# EAGLE design robot_booster (EAGLE 7.5.0)
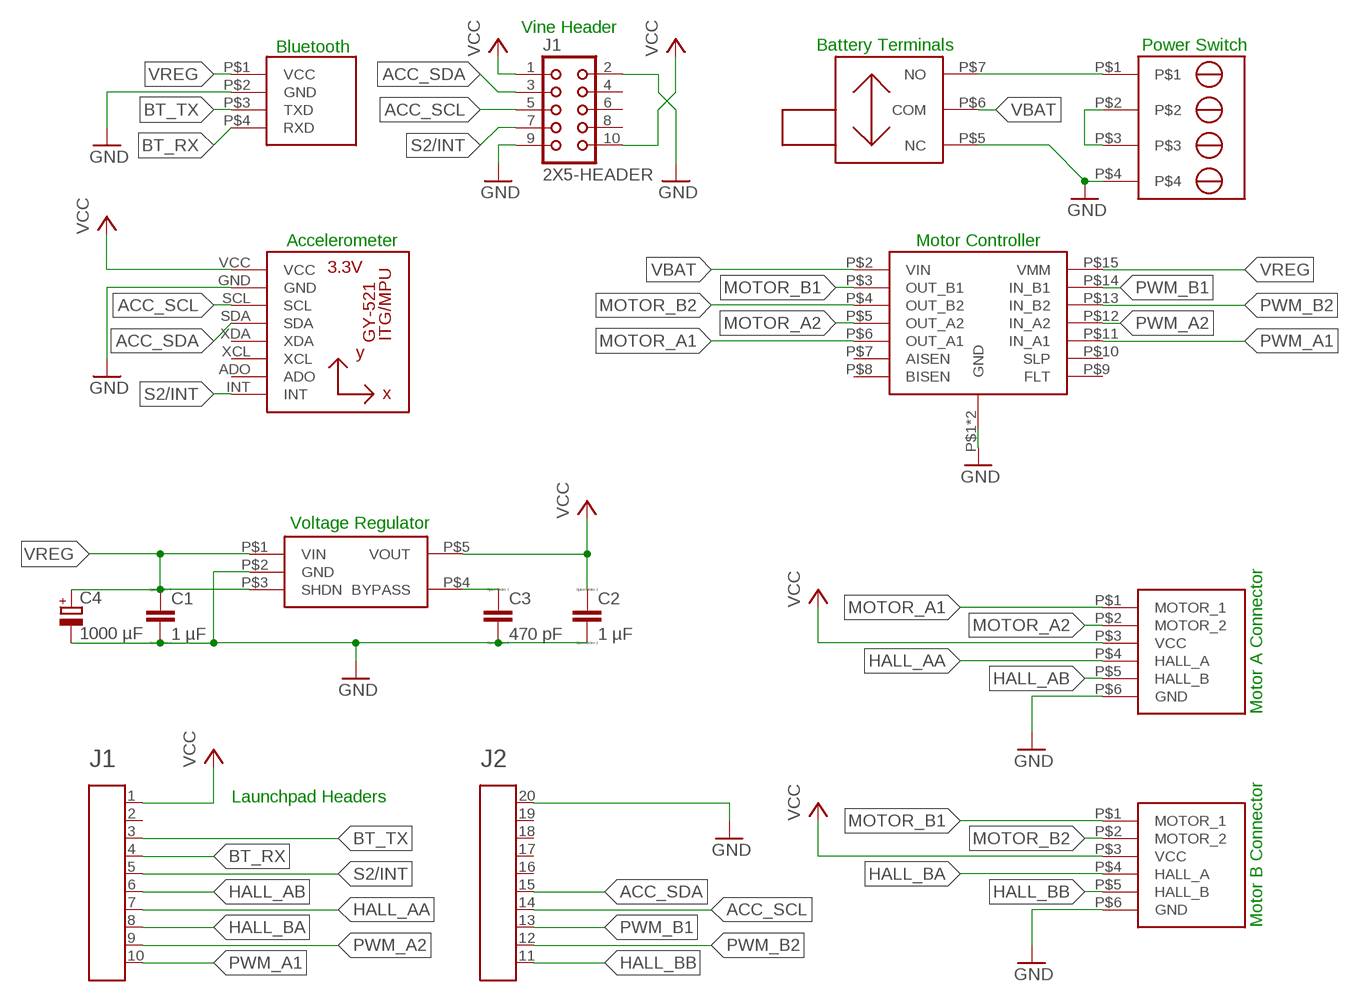
[diagram p0: schematic, sheet 1]

## Parts
C1  1 µF  CC0603  [C0603]
C2  1 µF  CC0603  [C0603]
C3  470 pF  CC0603  [C0603]
C4  1000 µF  CPOL-EUE5-5  [E5-5]
J1  2X5-HEADER  [2X5_1.27MM_SMALL]
U1  GY-521-HEADER  [GY-521-HEADER]
U$1  HEADER2X10-BOOSTERPACK  [2X10-BOOSTERPACK]
U$2  POLOLU-MICROMETAL-ENCODER  [2MM-1X6-JST]
U$3  POLOLU-MICROMETAL-ENCODER  [2MM-1X6-JST]
U$4  POLOLU-DRV8833  [HEADER-2X8-4W]
U$5  TC1015  [5-PIN-SOT-23]
U$6  HC06-RIGHT-ANGLE-HEADER  [HEADER-4X1-RIGHT-ANGLE]
U$7  1X4-SCREW-TERMINAL-BLOCK-OSTTE040104  [1X04-SCREW-TERMINAL-BLOCK-OSTTE040104]
U$8  SWITCH-EG1224  [SWITCH-EG122-RIGHT-ANGLE]

## Nets
ACC_SCL: J1.5 U1.SCL U$1.14
ACC_SDA: J1.3 U1.SDA U$1.15
BT_RX: U$1.4 U$6.P$4(RXD)
BT_TX: U$1.3 U$6.P$3(TXD)
GND [HiPWR]: C1.2 C2.2 C3.2 C4.- J1.2 J1.9 U1.GND U$1.20 U$2.P$6(GND) U$3.P$6(GND) U$4.P$1(GND) U$4.P$16(GND) U$5.P$2(GND) U$6.P$2(GND) U$7.P$4 U$8.P$5(NC)
HALL_AA: U$1.7 U$2.P$4(HALL_A)
HALL_AB: U$1.6 U$2.P$5(HALL_B)
HALL_BA: U$1.8 U$3.P$4(HALL_A)
HALL_BB: U$1.11 U$3.P$5(HALL_B)
MOTOR_A1 [PWR]: U$2.P$1(MOTOR_1) U$4.P$6(OUT_A1)
MOTOR_A2 [PWR]: U$2.P$2(MOTOR_2) U$4.P$5(OUT_A2)
MOTOR_B1 [PWR]: U$3.P$1(MOTOR_1) U$4.P$3(OUT_B1)
MOTOR_B2 [PWR]: U$3.P$2(MOTOR_2) U$4.P$4(OUT_B2)
N$1 [HiPWR]: U$7.P$2 U$7.P$3
N$2 [HiPWR]: U$7.P$1 U$8.P$7(NO)
N$5: C3.1 U$5.P$4(BYPASS)
PWM_A1: U$1.10 U$4.P$11(IN_A1)
PWM_A2: U$1.9 U$4.P$12(IN_A2)
PWM_B1: U$1.13 U$4.P$14(IN_B1)
PWM_B2: U$1.12 U$4.P$13(IN_B2)
S2/INT: J1.7 U1.INT U$1.5
VBAT [HiPWR]: U$4.P$2(VIN) U$8.P$6(COM)
VCC [PWR]: C2.1 J1.1 J1.10 U1.VCC U$1.1 U$2.P$3(VCC) U$3.P$3(VCC) U$5.P$5(VOUT)
VREG [PWR]: C1.1 C4.+ U$4.P$15(VMM) U$5.P$1(VIN) U$5.P$3(SHDN) U$6.P$1(VCC)
Unconnected: J1.4 J1.6 J1.8 U1.ADO U1.XCL U1.XDA U$1.2 U$1.16 U$1.17 U$1.18 U$1.19 U$4.P$7(AISEN) U$4.P$8(BISEN) U$4.P$9(FLT) U$4.P$10(SLP)

## Notes on the sheet
- Vine Header
- Bluetooth | Battery Terminals | Power Switch
- Accelerometer | Motor Controller
- Voltage Regulator
- Motor A Connector
- Launchpad Headers
- Motor B Connector

## Library data of the parts
C1-C3 = eagle-ltspice:C: CAPACITOR, European symbol; SPICEMODEL: NONE; SPICEPREFIX: C
C4 = rcl:CPOL-EU: POLARIZED CAPACITOR, European symbol
J1 = 00_headers:2X5-HEADER
U1 = gy-521:GY-521-HEADER
U$1 = EAGLE_BoosterPack_Library:HEADER2X10-BOOSTERPACK
U$2 U$3 = 00_peripherals:POLOLU-MICROMETAL-ENCODER
U$4 = 00_peripherals:POLOLU-DRV8833
U$5 = 00_peripherals:TC1015
U$6 = 00_peripherals:HC06-RIGHT-ANGLE-HEADER
U$7 = 00_headers:1X4-SCREW-TERMINAL-BLOCK-OSTTE040104
U$8 = 00_peripherals:SWITCH-EG1224

## Net classes
0 default: drill 0.254 mm
1 PWR: width 0.406 mm, drill 0.305 mm
2 HiPWR: width 0.406 mm, drill 0.406 mm

## Board
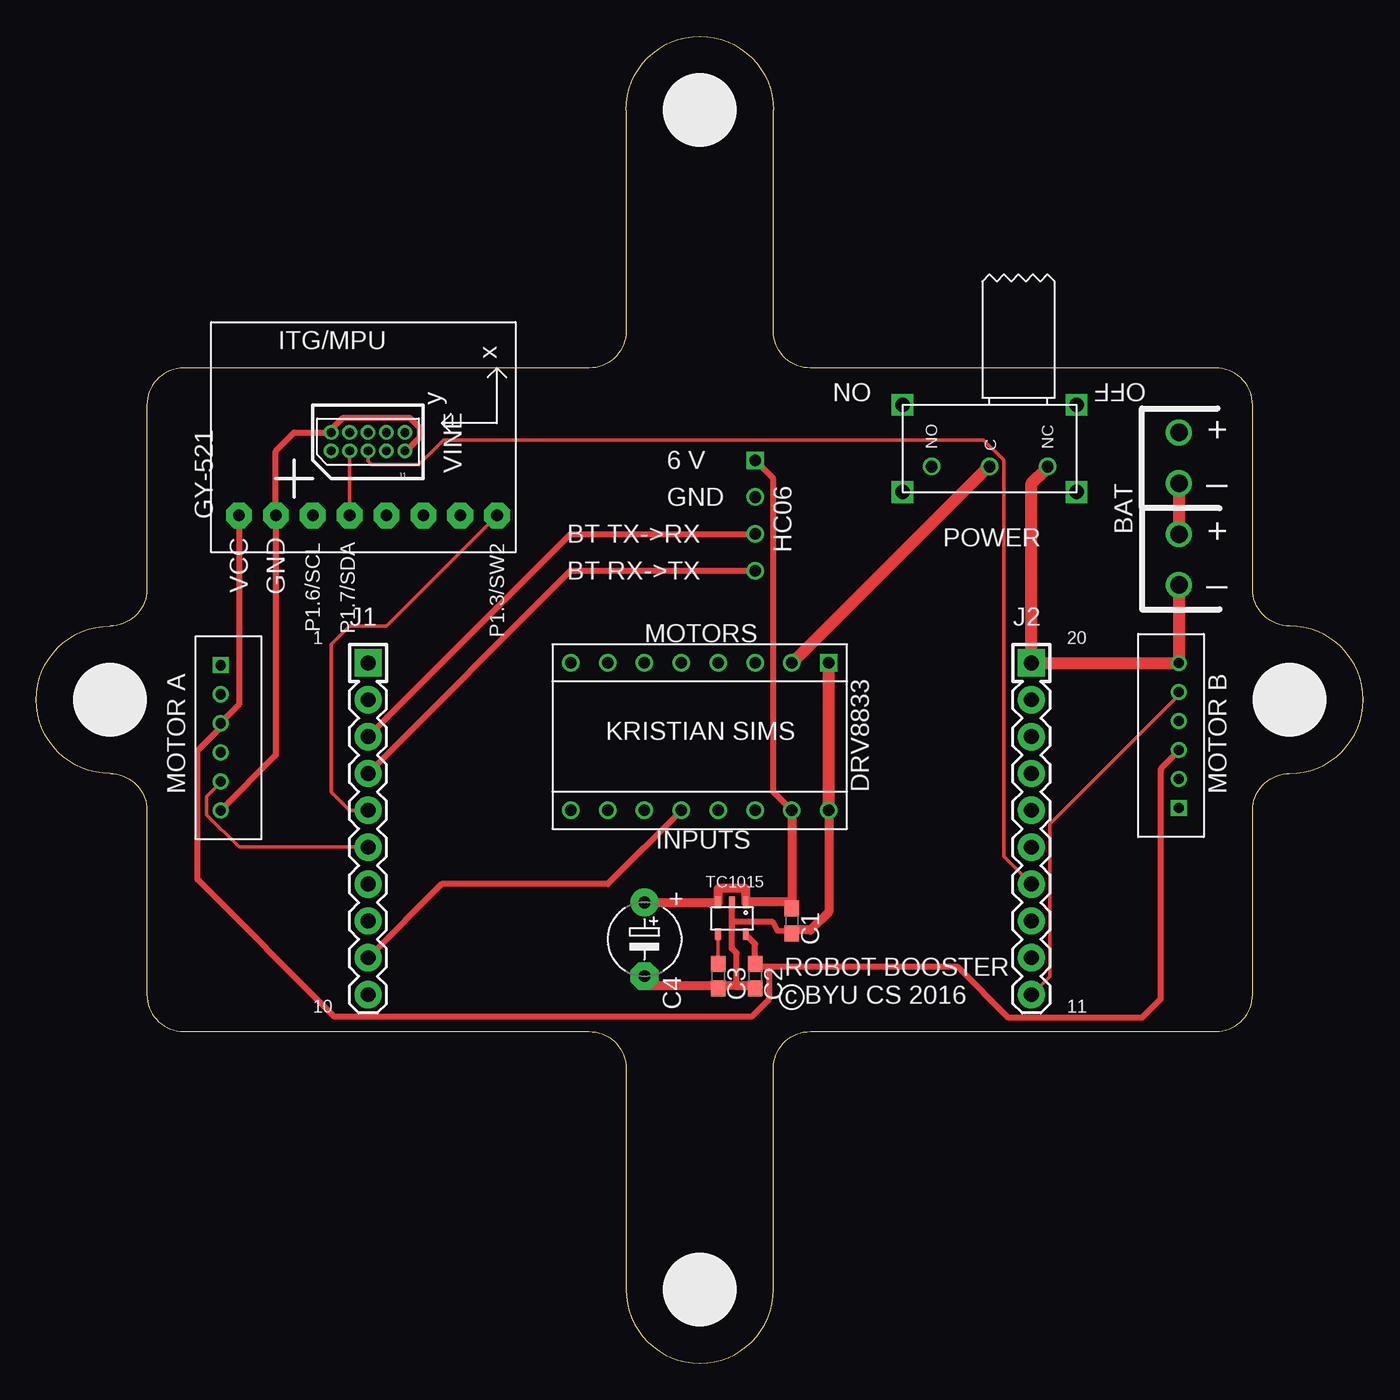
[diagram p1: board, top side]
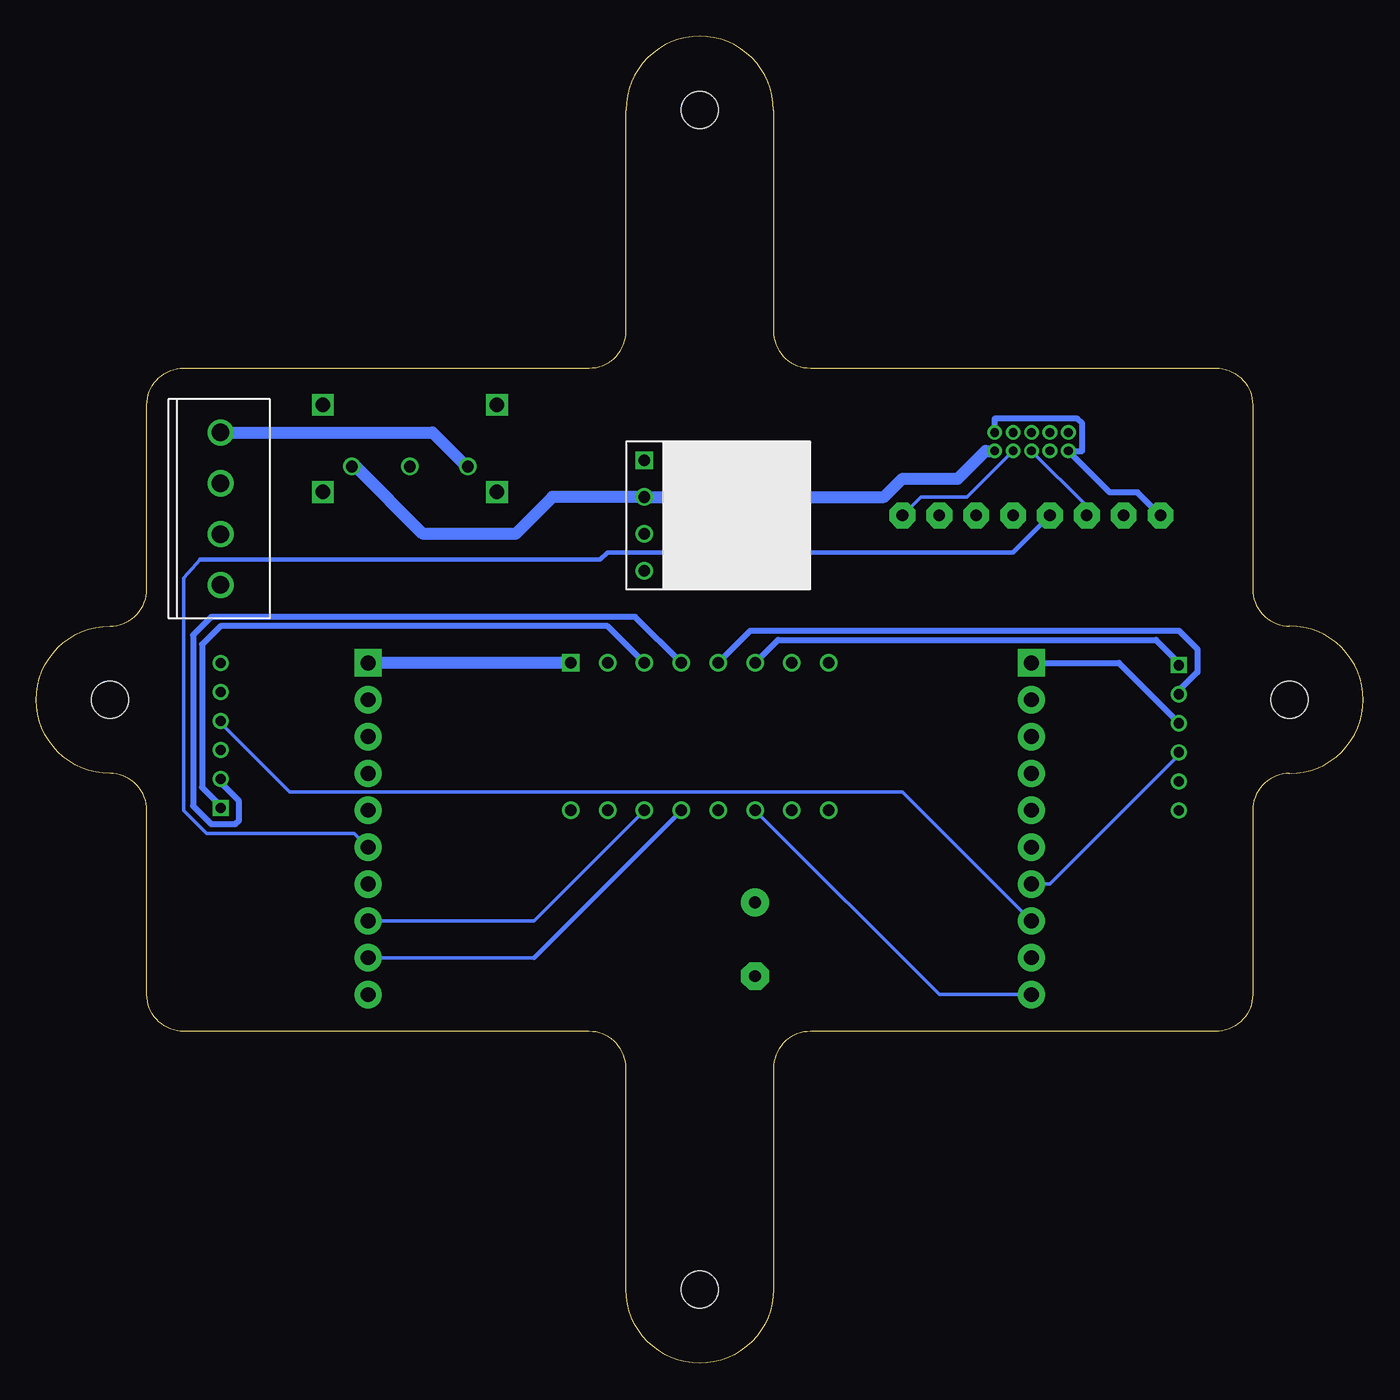
[diagram p2: board, bottom side, seen from below]

Size 91.44 x 91.44 mm. Coordinates in mm from the lower left corner, seen from the top.
Outline: 7.62,38.1 7.62,25.4 arc90 10.16,22.86 38.1,22.86 arc-90 40.64,20.32 40.64,5.08 arc180 50.8,5.08 50.8,20.32 arc-90 53.34,22.86 81.28,22.86 arc90 83.82,25.4 83.82,38.1 arc-90 86.36,40.64 arc180 86.36,50.8 arc-90 83.82,53.34 83.82,66.04 arc90 81.28,68.58 53.34,68.58 arc-90 50.8,71.12 50.8,86.36 arc180 40.64,86.36 40.64,71.12 arc-90 38.1,68.58 10.16,68.58 arc90 7.62,66.04 7.62,53.34 arc-90 5.08,50.8 arc180 5.08,40.64 arc-90 7.62,38.1
Copper layers (1*16): Top 0.035mm / dielectric 1.5mm / Bottom 0.035mm
Design rules "default *": minimum track width 10mil, minimum drill 10mil, track to track 8mil, track to pad 8mil, pad to pad 8mil, via to via 8mil, smd to smd 8mil, copper to edge 20mil, drill to drill 8mil, minimum pad ring 8mil, minimum via ring 8mil, stop-mask expansion 4mil, vias tented up to drill 0mil, thermal gap 10mil
Holes 2.54 mm at 5.08,45.72 45.72,5.08 86.36,45.72 45.72,86.36

### Footprints (pad centres in the part's own frame; a part is rotated, then mirrored left to right if it is on the bottom)
C0603 = smd 1.1 x 1: 1 -0.85,0; 2 0.85,0
E5-5 = drill 0.813 pad 1.905: + -2.54,0 | drill 0.813 pad 1.905 octagon: - 2.54,0
2X5_1.27MM_SMALL = drill 0.6 pad 0.813: 1 -0.635,2.54; 2 0.635,2.54; 3 -0.635,1.27; 4 0.635,1.27; 5 -0.635,0; 6 0.635,0; 7 -0.635,-1.27; 8 0.635,-1.27; 9 -0.635,-2.54; 10 0.635,-2.54
GY-521-HEADER = drill 0.8 pad 1.778 octagon: ADO -8.89,-6.35; GND -8.89,6.35; INT -8.89,-8.89; SCL -8.89,3.81; SDA -8.89,1.27; VCC -8.89,8.89; XCL -8.89,-3.81; XDA -8.89,-1.27
2X10-BOOSTERPACK = drill 1.016 pad 1.88 square: 1 0,10.16; 20 45.72,10.16 | drill 1.016 pad 1.88: 2 0,7.62; 3 0,5.08; 4 0,2.54; 5 0,0; 6 0,-2.54; 7 0,-5.08; 8 0,-7.62; 9 0,-10.16; 10 0,-12.7; 11 45.72,-12.7; 12 45.72,-10.16; 13 45.72,-7.62; 14 45.72,-5.08; 15 45.72,-2.54; 16 45.72,0; 17 45.72,2.54; 18 45.72,5.08; 19 45.72,7.62
2MM-1X6-JST = drill 0.7 square: P$1 0,10 | drill 0.7: P$2 0,8; P$3 0,6; P$4 0,4; P$5 0,2; P$6 0,0
HEADER-2X8-4W = drill 0.8 square: P$1 0,17.78 | drill 0.8: P$2 0,15.24; P$3 0,12.7; P$4 0,10.16; P$5 0,7.62; P$6 0,5.08; P$7 0,2.54; P$8 0,0; P$9 10.16,0; P$10 10.16,2.54; P$11 10.16,5.08; P$12 10.16,7.62; P$13 10.16,10.16; P$14 10.16,12.7; P$15 10.16,15.24; P$16 10.16,17.78
5-PIN-SOT-23 = smd 0.813 x 0.406: P$1 0,1.9; P$2 0,0.95; P$3 0,0; P$4 2.184,0; P$5 2.184,1.9
HEADER-4X1-RIGHT-ANGLE = drill 0.8 square: P$1 0,7.62 | drill 0.8: P$2 0,5.08; P$3 0,2.54; P$4 0,0
1X04-SCREW-TERMINAL-BLOCK-OSTTE040104 = drill 1.2: P$1 0,0; P$2 0,3.5; P$3 0,7; P$4 0,10.5
SWITCH-EG122-RIGHT-ANGLE = drill 1 square: P$1 0,0; P$2 6,0; P$3 6,12; P$4 0,12 | drill 0.8: P$5 4.25,10; P$6 4.25,6; P$7 4.25,2

### Placement (x,y rotation side)
C1  52.07,30.48 270 top
C2  49.53,26.67 270 top
C3  46.99,26.67 270 top
C4  41.91,29.21 270 top
J1  22.86,63.5 90 top
U1  22.86,67.31 90 top
U$1  22.86,38.1 0 top
U$2  12.7,38.1 0 top
U$3  78.74,48.26 180 top
U$4  36.83,48.26 270 top
U$5  46.99,31.75 270 top
U$6  49.53,54.61 0 bottom
U$7  78.74,64.13 180 bottom
U$8  59.69,66.04 270 top

### Tracks (layer width: path | path; a pad name or v marks a point on that pad's centre or on a via)
ACC_SCL
  Top 0.254: U$1.14 66.67,34.92 66.67,62.23 65.28,63.63 28.07,63.63 27.62,63.18 26.35,61.91 23.11,61.91 22.86,62.17 J1.5
  Bottom 0.254: J1.5 19.05,59.05 U1.SCL
ACC_SDA
  Top 0.254: U1.SDA J1.3
  Bottom 0.254: U$1.15 69.53,36.51 79.69,36.51 81.28,38.1 81.28,54.1 80.14,55.37
  Bottom 0.305: 80.14,55.37 52.58,55.37 52.07,55.88 24.13,55.88 U1.SDA
BT_RX
  Top 0.406: U$1.4 36.83,54.61 U$6.P$4
BT_TX
  Top 0.406: U$1.3 36.83,57.15 U$6.P$3
GND
  Top 0.406: U$2.P$6 16.51,41.91 U1.GND 16.51,62.86 17.78,64.13 J1.2 20.46,64.47 21.14,65.15 25.72,65.15 26.4,64.47 26.4,63.78 25.49,62.86 J1.9 | 47.94,26.04 46.99,26.04 C3.2 46.67,26.04 | 47.94,26.04 48.26,26.04 48.26,28.26 47.93,28.57 47.93,29.86 | 49.53,26.04 C2.2 | 47.94,26.04 47.55,26.02 | C4.- 41.91,26.04 | 52.07,29.84 C1.2 52.06,29.81 51.08,29.82 50.75,30.4 47.93,30.4 47.93,29.86 | 47.93,29.86 U$5.P$2
  Top 0.61: 47.55,26.02 48.26,26.04 49.53,26.04 | 41.91,26.04 46.67,26.04 | U$4.P$16 54.61,31.11 53.34,29.84 52.07,29.84
  Top 0.813: U$7.P$4 U$3.P$6 U$1.20 68.58,60.64 69.53,61.59 U$8.P$5 | U$4.P$16 U$4.P$1
  Bottom 0.813: U$4.P$1 U$1.20 | J1.9 26.04,62.86 27.94,60.96 31.75,60.96 33.02,59.69 U$6.P$2 55.88,59.69 58.42,57.15 64.77,57.15 69.41,61.79 U$8.P$5
HALL_AA
  Bottom 0.254: U$1.7 21.59,33.02 12.7,41.91 U$2.P$4
HALL_AB
  Top 0.254: U$1.6 13.97,35.56 11.75,37.78 11.75,39.05 12.7,40 U$2.P$5
HALL_BA
  Bottom 0.254: U$1.8 31.75,39.37 73.98,39.37 78.74,44.13 U$3.P$4
HALL_BB
  Top 0.254: U$1.11 69.85,26.67 69.85,37.15 78.74,46.04 U$3.P$5
MOTOR_A1
  Bottom 0.406: U$4.P$6 40.32,49.85 14.29,49.85 12.7,48.26 U$2.P$1
MOTOR_A2
  Bottom 0.406: U$4.P$5 42.23,50.48 12.7,50.48 11.43,49.21 11.43,47.62 12.7,46.35 U$2.P$2
MOTOR_B1
  Bottom 0.406: U$4.P$3 52.07,50.8 78.74,50.8 80.01,49.53 80.01,39.69 78.74,38.42 U$3.P$1
MOTOR_B2
  Bottom 0.406: U$4.P$4 50.16,51.44 79.38,51.44 80.64,50.16 80.64,38.42 79.38,37.15 77.72,37.15 77.47,37.4 77.47,38.73 78.74,40 U$3.P$2
N$1
  Top 0.813: U$7.P$2 U$7.P$3
N$2
  Bottom 0.813: U$7.P$1 64.13,64.13 61.91,61.91 U$8.P$7
N$5
  Top 0.254: C3.1 U$5.P$4
PWM_A1
  Bottom 0.254: U$4.P$11 29.21,25.4 U$1.10
PWM_A2
  Top 0.406: U$4.P$12 39.37,33.02 27.94,33.02 U$1.9
PWM_B1
  Bottom 0.254: U$4.P$14 57.15,30.48 U$1.13
PWM_B2
  Bottom 0.254: U$1.12 57.15,27.94
  Bottom 0.305: 57.15,27.94 U$4.P$13
S2/INT
  Top 0.254: U$1.5 21.59,38.1 20.32,39.37 20.32,49.53 21.59,50.8 24.13,50.8 U1.INT
  Bottom 0.254: J1.7 27.3,59.69 30.48,59.69 U1.INT
VBAT
  Top 0.813: U$4.P$2 65.41,61.59 U$8.P$6
VCC
  Top 0.406: U1.VCC 13.97,45.4 12.7,44.13 U$2.P$3 12.7,43.81 11.11,42.23 11.11,33.34 20.57,23.88 49.28,23.88 50.48,25.08 50.48,27.3 | 50.48,27.3 49.53,27.3 C2.1 49.53,28.89 48.89,29.53 48.92,29.6 U$5.P$5 | U$3.P$3 78.74,42.23 77.54,41.03 77.47,40.85 77.47,25.08 76.2,23.81 66.99,23.81 63.5,27.3 50.48,27.3
  Bottom 0.406: U$1.1 16.83,48.26 12.7,44.13 U$2.P$3 | U1.VCC 15.56,60.01 17.46,60.01 J1.1 19.37,62.86 19.37,64.77 19.68,65.09 25.38,65.09 | 25.38,65.09 25.4,65.09 | 25.38,65.09 25.38,64.24 J1.10
VREG
  Top 0.406: 52.07,31.43 C1.1 51.89,31.77 | U$6.P$1 50.8,60.96 50.8,39.37 U$4.P$15 | U$5.P$1 49.03,31.77
  Top 0.61: C4.+ U$5.P$3 46.99,32.7 48.89,32.7 U$5.P$1 | U$4.P$15 C1.1 | 51.89,31.77 49.03,31.77

### Text on the board
_tsilk: ON | OFF | + | NO | C | NC | VINE | 6 V | _ | GND | GY-521 | BT TX->RX | POWER | BAT | + | HC06 | BT RX->TX | _ | VCC | GND | P1.6/SCL | P1.7/SDA | P1.3/SW2 | MOTORS | KRISTIAN SIMS | MOTOR A | DRV8833 | MOTOR B | INPUTS | TC1015 | + | ROBOT BOOSTER / c BYU CS 2016